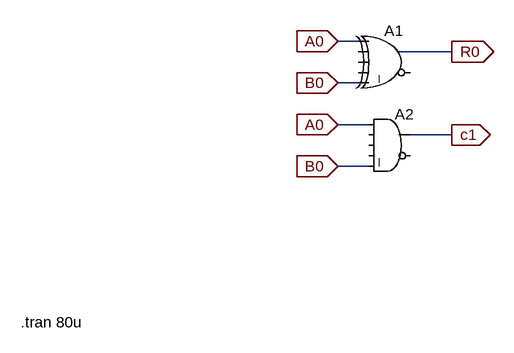
[diagram p0: schematic half_adder.asc]
half_adder.asc, the LTspice schematic file:
Version 4
SHEET 1 1208 680
WIRE 304 -48 272 -48
WIRE 448 -32 368 -32
WIRE 304 16 272 16
WIRE 320 80 272 80
WIRE 448 96 384 96
WIRE 320 144 272 144
FLAG 272 -48 A0
IOPIN 272 -48 In
FLAG 272 16 B0
IOPIN 272 16 In
FLAG 272 80 A0
IOPIN 272 80 In
FLAG 272 144 B0
IOPIN 272 144 In
FLAG 448 96 c1
IOPIN 448 96 Out
FLAG 448 -32 R0
IOPIN 448 -32 Out
SYMBOL Digital\\xor 352 -80 R0
SYMATTR InstName A1
SYMBOL Digital\\and 352 48 R0
SYMATTR InstName A2
TEXT -216 384 Left 2 !.tran 80u

The netlist it stands for:
* half_adder.asc
A1 A0 0 0 0 B0 0 R0 0 XOR
A2 A0 0 0 0 B0 0 c1 0 AND
.tran 80u
.backanno
.end